# EAGLE schematic Overview_Schematic (EAGLE 9.6.2)
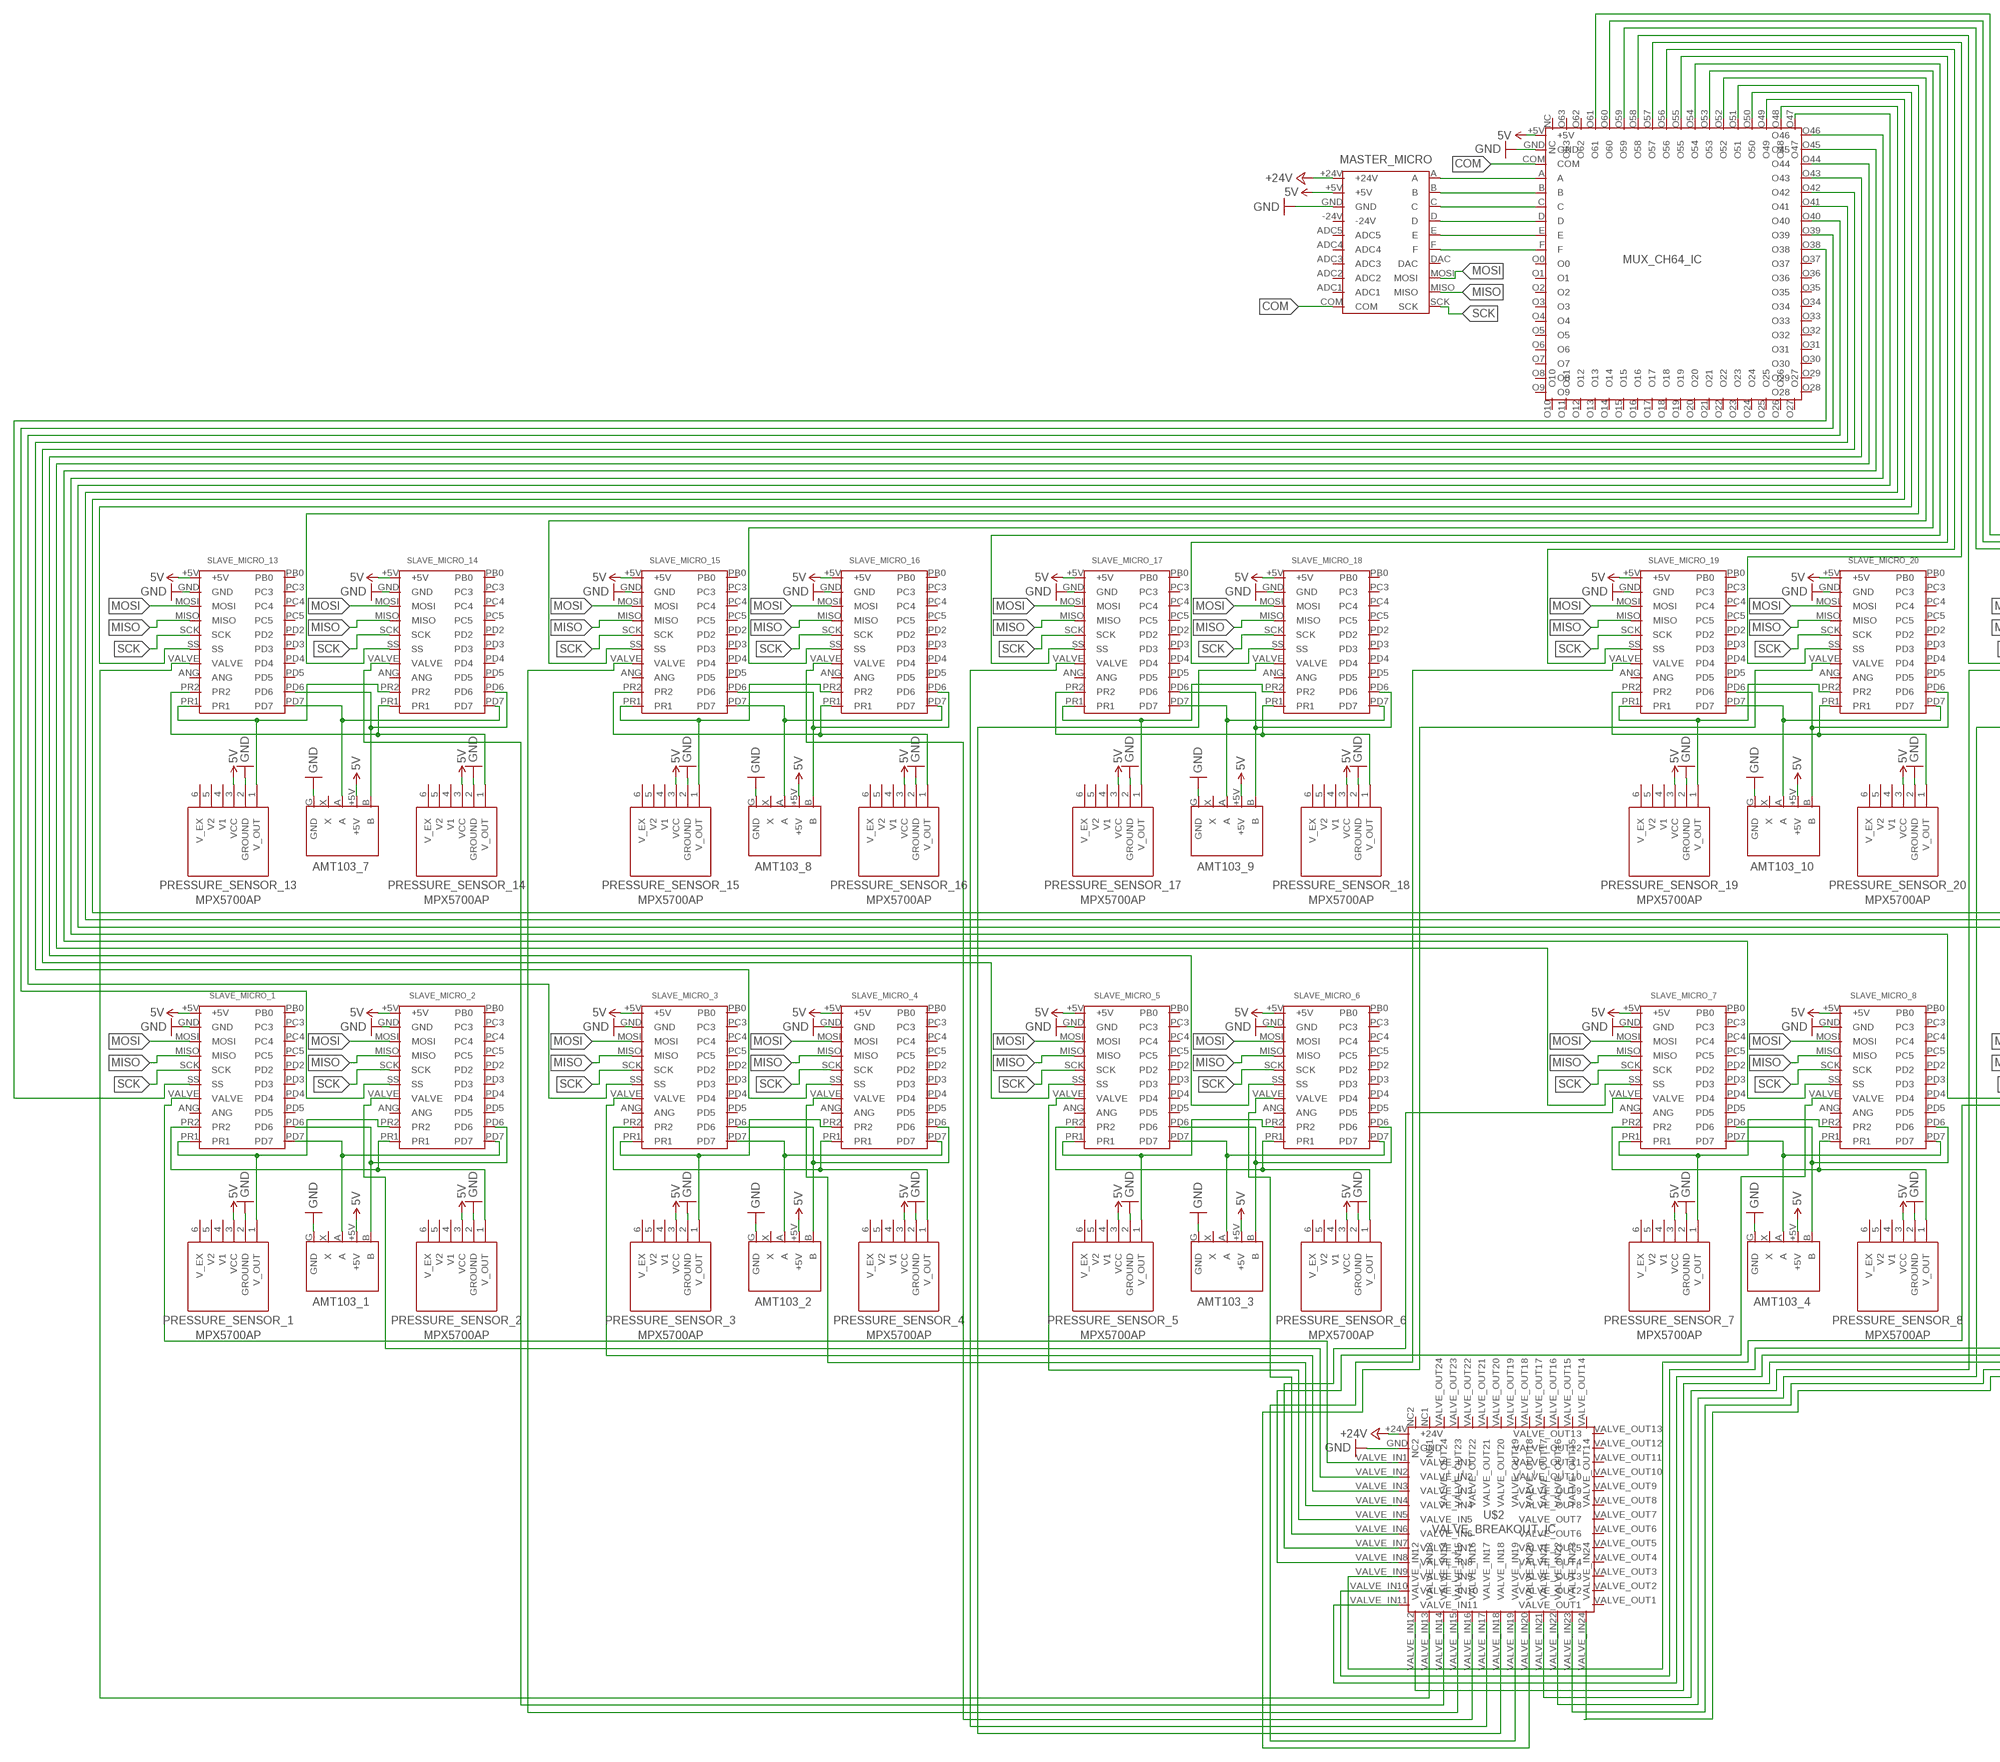
[diagram p0: schematic, sheet 1, part 1 of 2]
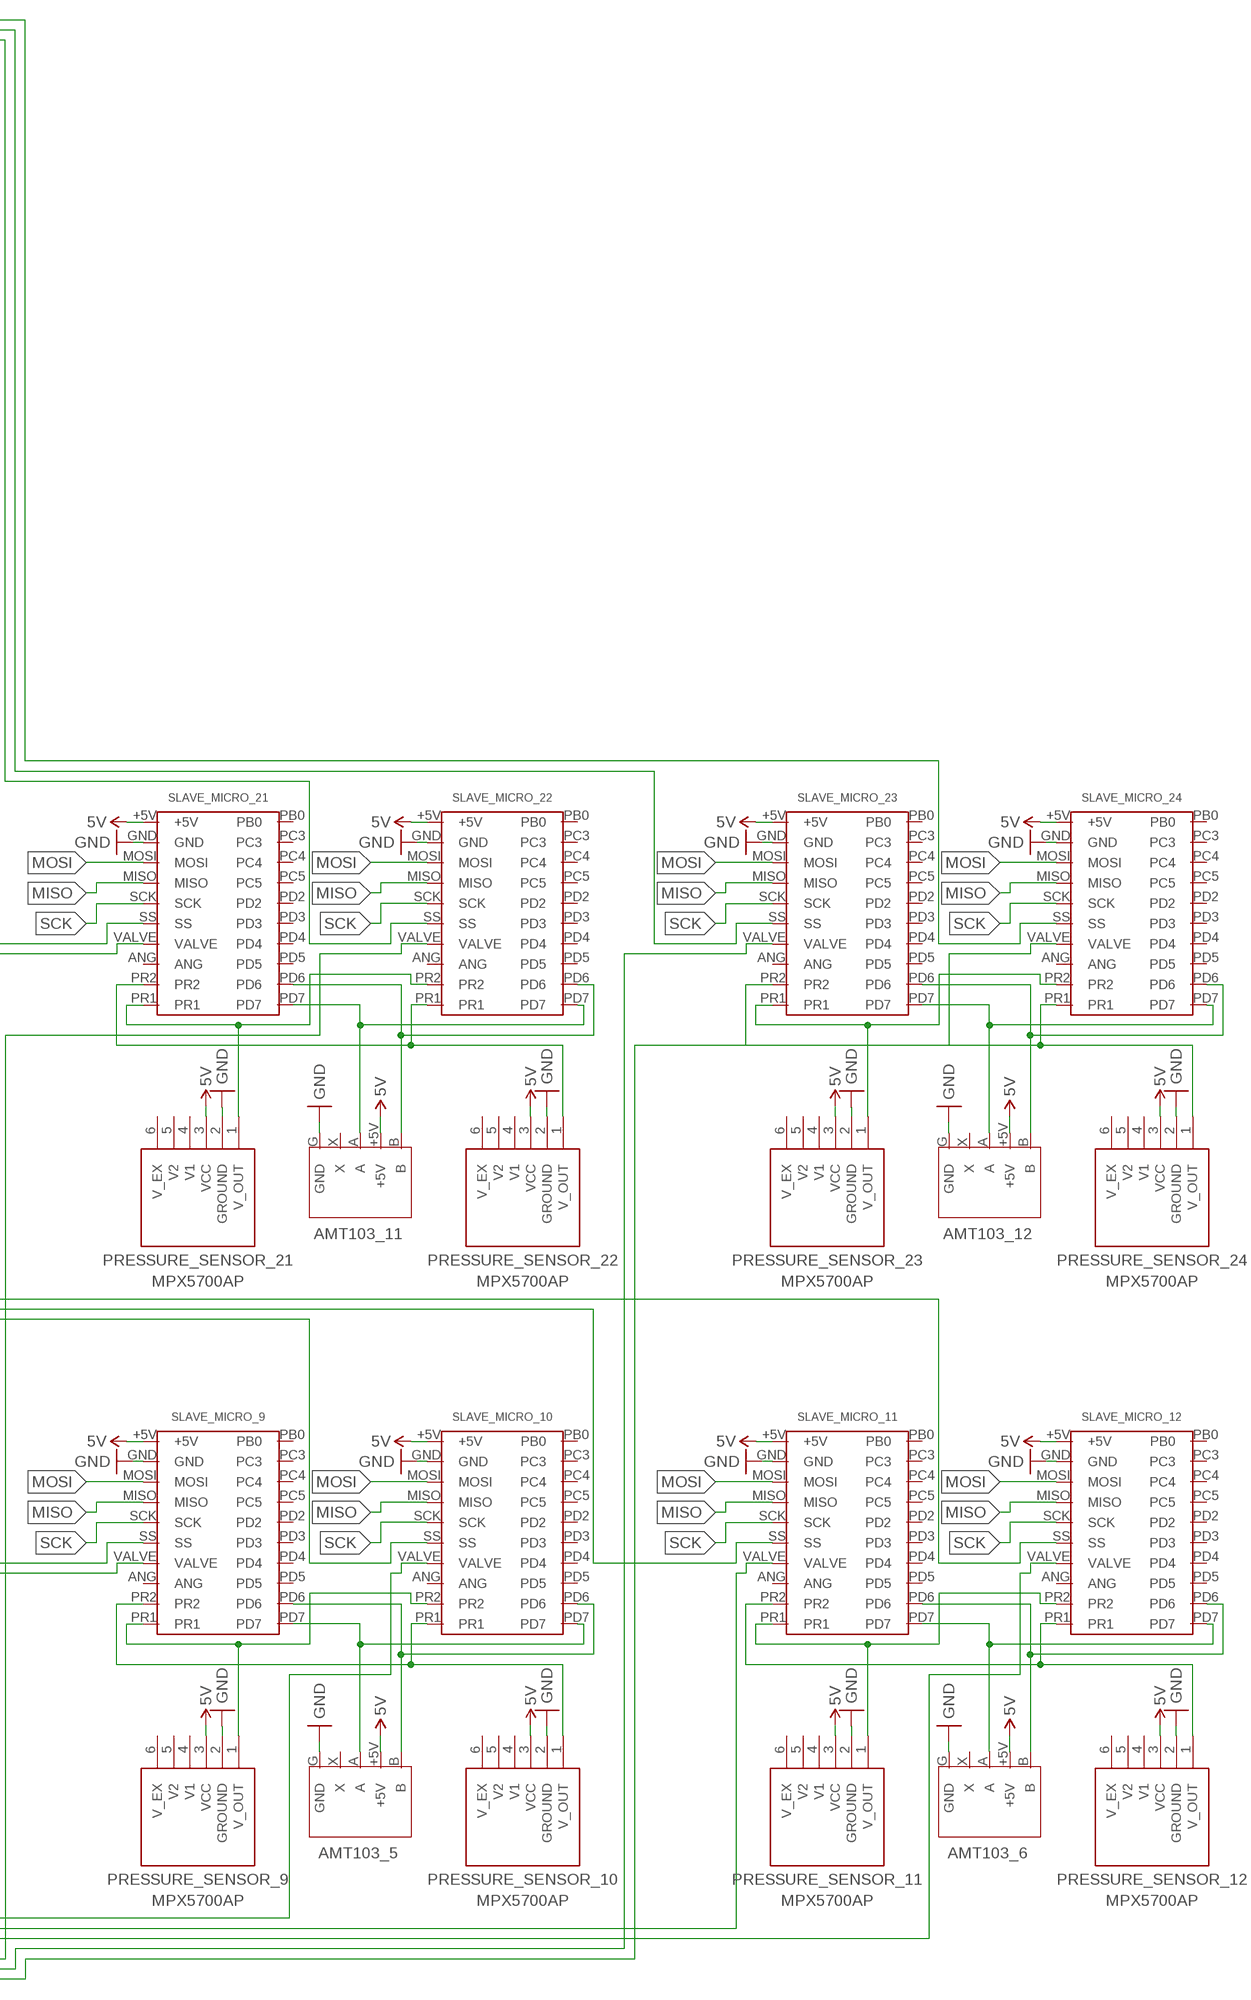
[diagram p1: schematic, sheet 1, part 2 of 2]

## Parts
AMT103_1  AMT103_ENCODER  [AMT103_ENCODER]
AMT103_2  AMT103_ENCODER  [AMT103_ENCODER]
AMT103_3  AMT103_ENCODER  [AMT103_ENCODER]
AMT103_4  AMT103_ENCODER  [AMT103_ENCODER]
AMT103_5  AMT103_ENCODER  [AMT103_ENCODER]
AMT103_6  AMT103_ENCODER  [AMT103_ENCODER]
AMT103_7  AMT103_ENCODER  [AMT103_ENCODER]
AMT103_8  AMT103_ENCODER  [AMT103_ENCODER]
AMT103_9  AMT103_ENCODER  [AMT103_ENCODER]
AMT103_10  AMT103_ENCODER  [AMT103_ENCODER]
AMT103_11  AMT103_ENCODER  [AMT103_ENCODER]
AMT103_12  AMT103_ENCODER  [AMT103_ENCODER]
MASTER_MICRO  MASTER_MICRO  [MASTER_MICRO]
MUX_CH64_IC  MUX_64CH_IC  [MUX_64CH_IC]
PRESSURE_SENSOR_1  MPX5700AP  [MPX5700AP]
PRESSURE_SENSOR_2  MPX5700AP  [MPX5700AP]
PRESSURE_SENSOR_3  MPX5700AP  [MPX5700AP]
PRESSURE_SENSOR_4  MPX5700AP  [MPX5700AP]
PRESSURE_SENSOR_5  MPX5700AP  [MPX5700AP]
PRESSURE_SENSOR_6  MPX5700AP  [MPX5700AP]
PRESSURE_SENSOR_7  MPX5700AP  [MPX5700AP]
PRESSURE_SENSOR_8  MPX5700AP  [MPX5700AP]
PRESSURE_SENSOR_9  MPX5700AP  [MPX5700AP]
PRESSURE_SENSOR_10  MPX5700AP  [MPX5700AP]
PRESSURE_SENSOR_11  MPX5700AP  [MPX5700AP]
PRESSURE_SENSOR_12  MPX5700AP  [MPX5700AP]
PRESSURE_SENSOR_13  MPX5700AP  [MPX5700AP]
PRESSURE_SENSOR_14  MPX5700AP  [MPX5700AP]
PRESSURE_SENSOR_15  MPX5700AP  [MPX5700AP]
PRESSURE_SENSOR_16  MPX5700AP  [MPX5700AP]
PRESSURE_SENSOR_17  MPX5700AP  [MPX5700AP]
PRESSURE_SENSOR_18  MPX5700AP  [MPX5700AP]
PRESSURE_SENSOR_19  MPX5700AP  [MPX5700AP]
PRESSURE_SENSOR_20  MPX5700AP  [MPX5700AP]
PRESSURE_SENSOR_21  MPX5700AP  [MPX5700AP]
PRESSURE_SENSOR_22  MPX5700AP  [MPX5700AP]
PRESSURE_SENSOR_23  MPX5700AP  [MPX5700AP]
PRESSURE_SENSOR_24  MPX5700AP  [MPX5700AP]
SLAVE_MICRO_1  SLAVE_MICRO  [SLAVE_MICRO]
SLAVE_MICRO_2  SLAVE_MICRO  [SLAVE_MICRO]
SLAVE_MICRO_3  SLAVE_MICRO  [SLAVE_MICRO]
SLAVE_MICRO_4  SLAVE_MICRO  [SLAVE_MICRO]
SLAVE_MICRO_5  SLAVE_MICRO  [SLAVE_MICRO]
SLAVE_MICRO_6  SLAVE_MICRO  [SLAVE_MICRO]
SLAVE_MICRO_7  SLAVE_MICRO  [SLAVE_MICRO]
SLAVE_MICRO_8  SLAVE_MICRO  [SLAVE_MICRO]
SLAVE_MICRO_9  SLAVE_MICRO  [SLAVE_MICRO]
SLAVE_MICRO_10  SLAVE_MICRO  [SLAVE_MICRO]
SLAVE_MICRO_11  SLAVE_MICRO  [SLAVE_MICRO]
SLAVE_MICRO_12  SLAVE_MICRO  [SLAVE_MICRO]
SLAVE_MICRO_13  SLAVE_MICRO  [SLAVE_MICRO]
SLAVE_MICRO_14  SLAVE_MICRO  [SLAVE_MICRO]
SLAVE_MICRO_15  SLAVE_MICRO  [SLAVE_MICRO]
SLAVE_MICRO_16  SLAVE_MICRO  [SLAVE_MICRO]
SLAVE_MICRO_17  SLAVE_MICRO  [SLAVE_MICRO]
SLAVE_MICRO_18  SLAVE_MICRO  [SLAVE_MICRO]
SLAVE_MICRO_19  SLAVE_MICRO  [SLAVE_MICRO]
SLAVE_MICRO_20  SLAVE_MICRO  [SLAVE_MICRO]
SLAVE_MICRO_21  SLAVE_MICRO  [SLAVE_MICRO]
SLAVE_MICRO_22  SLAVE_MICRO  [SLAVE_MICRO]
SLAVE_MICRO_23  SLAVE_MICRO  [SLAVE_MICRO]
SLAVE_MICRO_24  SLAVE_MICRO  [SLAVE_MICRO]
U$2  VALVE_BREAKOUT_IC  [VALVE_BREAKOUT_IC]

## Nets
5V: AMT103_1.+5V AMT103_2.+5V AMT103_3.+5V AMT103_4.+5V AMT103_5.+5V AMT103_6.+5V AMT103_7.+5V AMT103_8.+5V AMT103_9.+5V AMT103_10.+5V AMT103_11.+5V AMT103_12.+5V MASTER_MICRO.+5V MUX_CH64_IC.+5V PRESSURE_SENSOR_1.3(VCC) PRESSURE_SENSOR_2.3(VCC) PRESSURE_SENSOR_3.3(VCC) PRESSURE_SENSOR_4.3(VCC) PRESSURE_SENSOR_5.3(VCC) PRESSURE_SENSOR_6.3(VCC) PRESSURE_SENSOR_7.3(VCC) PRESSURE_SENSOR_8.3(VCC) PRESSURE_SENSOR_9.3(VCC) PRESSURE_SENSOR_10.3(VCC) PRESSURE_SENSOR_11.3(VCC) PRESSURE_SENSOR_12.3(VCC) PRESSURE_SENSOR_13.3(VCC) PRESSURE_SENSOR_14.3(VCC) PRESSURE_SENSOR_15.3(VCC) PRESSURE_SENSOR_16.3(VCC) PRESSURE_SENSOR_17.3(VCC) PRESSURE_SENSOR_18.3(VCC) PRESSURE_SENSOR_19.3(VCC) PRESSURE_SENSOR_20.3(VCC) PRESSURE_SENSOR_21.3(VCC) PRESSURE_SENSOR_22.3(VCC) PRESSURE_SENSOR_23.3(VCC) PRESSURE_SENSOR_24.3(VCC) SLAVE_MICRO_1.+5V SLAVE_MICRO_2.+5V SLAVE_MICRO_3.+5V SLAVE_MICRO_4.+5V SLAVE_MICRO_5.+5V SLAVE_MICRO_6.+5V SLAVE_MICRO_7.+5V SLAVE_MICRO_8.+5V SLAVE_MICRO_9.+5V SLAVE_MICRO_10.+5V SLAVE_MICRO_11.+5V SLAVE_MICRO_12.+5V SLAVE_MICRO_13.+5V SLAVE_MICRO_14.+5V SLAVE_MICRO_15.+5V SLAVE_MICRO_16.+5V SLAVE_MICRO_17.+5V SLAVE_MICRO_18.+5V SLAVE_MICRO_19.+5V SLAVE_MICRO_20.+5V SLAVE_MICRO_21.+5V SLAVE_MICRO_22.+5V SLAVE_MICRO_23.+5V SLAVE_MICRO_24.+5V
+24V: MASTER_MICRO.+24V U$2.+24V
COM: MASTER_MICRO.COM MUX_CH64_IC.COM
GND: AMT103_1.G(GND) AMT103_2.G(GND) AMT103_3.G(GND) AMT103_4.G(GND) AMT103_5.G(GND) AMT103_6.G(GND) AMT103_7.G(GND) AMT103_8.G(GND) AMT103_9.G(GND) AMT103_10.G(GND) AMT103_11.G(GND) AMT103_12.G(GND) MASTER_MICRO.GND MUX_CH64_IC.GND PRESSURE_SENSOR_1.2(GROUND) PRESSURE_SENSOR_2.2(GROUND) PRESSURE_SENSOR_3.2(GROUND) PRESSURE_SENSOR_4.2(GROUND) PRESSURE_SENSOR_5.2(GROUND) PRESSURE_SENSOR_6.2(GROUND) PRESSURE_SENSOR_7.2(GROUND) PRESSURE_SENSOR_8.2(GROUND) PRESSURE_SENSOR_9.2(GROUND) PRESSURE_SENSOR_10.2(GROUND) PRESSURE_SENSOR_11.2(GROUND) PRESSURE_SENSOR_12.2(GROUND) PRESSURE_SENSOR_13.2(GROUND) PRESSURE_SENSOR_14.2(GROUND) PRESSURE_SENSOR_15.2(GROUND) PRESSURE_SENSOR_16.2(GROUND) PRESSURE_SENSOR_17.2(GROUND) PRESSURE_SENSOR_18.2(GROUND) PRESSURE_SENSOR_19.2(GROUND) PRESSURE_SENSOR_20.2(GROUND) PRESSURE_SENSOR_21.2(GROUND) PRESSURE_SENSOR_22.2(GROUND) PRESSURE_SENSOR_23.2(GROUND) PRESSURE_SENSOR_24.2(GROUND) SLAVE_MICRO_1.GND SLAVE_MICRO_2.GND SLAVE_MICRO_3.GND SLAVE_MICRO_4.GND SLAVE_MICRO_5.GND SLAVE_MICRO_6.GND SLAVE_MICRO_7.GND SLAVE_MICRO_8.GND SLAVE_MICRO_9.GND SLAVE_MICRO_10.GND SLAVE_MICRO_11.GND SLAVE_MICRO_12.GND SLAVE_MICRO_13.GND SLAVE_MICRO_14.GND SLAVE_MICRO_15.GND SLAVE_MICRO_16.GND SLAVE_MICRO_17.GND SLAVE_MICRO_18.GND SLAVE_MICRO_19.GND SLAVE_MICRO_20.GND SLAVE_MICRO_21.GND SLAVE_MICRO_22.GND SLAVE_MICRO_23.GND SLAVE_MICRO_24.GND U$2.GND
MISO: MASTER_MICRO.MISO SLAVE_MICRO_1.MISO SLAVE_MICRO_2.MISO SLAVE_MICRO_3.MISO SLAVE_MICRO_4.MISO SLAVE_MICRO_5.MISO SLAVE_MICRO_6.MISO SLAVE_MICRO_7.MISO SLAVE_MICRO_8.MISO SLAVE_MICRO_9.MISO SLAVE_MICRO_10.MISO SLAVE_MICRO_11.MISO SLAVE_MICRO_12.MISO SLAVE_MICRO_13.MISO SLAVE_MICRO_14.MISO SLAVE_MICRO_15.MISO SLAVE_MICRO_16.MISO SLAVE_MICRO_17.MISO SLAVE_MICRO_18.MISO SLAVE_MICRO_19.MISO SLAVE_MICRO_20.MISO SLAVE_MICRO_21.MISO SLAVE_MICRO_22.MISO SLAVE_MICRO_23.MISO SLAVE_MICRO_24.MISO
MOSI: MASTER_MICRO.MOSI SLAVE_MICRO_1.MOSI SLAVE_MICRO_2.MOSI SLAVE_MICRO_3.MOSI SLAVE_MICRO_4.MOSI SLAVE_MICRO_5.MOSI SLAVE_MICRO_6.MOSI SLAVE_MICRO_7.MOSI SLAVE_MICRO_8.MOSI SLAVE_MICRO_9.MOSI SLAVE_MICRO_10.MOSI SLAVE_MICRO_11.MOSI SLAVE_MICRO_12.MOSI SLAVE_MICRO_13.MOSI SLAVE_MICRO_14.MOSI SLAVE_MICRO_15.MOSI SLAVE_MICRO_16.MOSI SLAVE_MICRO_17.MOSI SLAVE_MICRO_18.MOSI SLAVE_MICRO_19.MOSI SLAVE_MICRO_20.MOSI SLAVE_MICRO_21.MOSI SLAVE_MICRO_22.MOSI SLAVE_MICRO_23.MOSI SLAVE_MICRO_24.MOSI
N$1: MASTER_MICRO.A MUX_CH64_IC.A
N$2: MASTER_MICRO.B MUX_CH64_IC.B
N$3: MASTER_MICRO.C MUX_CH64_IC.C
N$4: MASTER_MICRO.D MUX_CH64_IC.D
N$5: MASTER_MICRO.E MUX_CH64_IC.E
N$6: MASTER_MICRO.F MUX_CH64_IC.F
N$7: MUX_CH64_IC.O38 SLAVE_MICRO_1.SS
N$8: AMT103_1.A SLAVE_MICRO_1.PD7 SLAVE_MICRO_2.PD7
N$9: AMT103_1.B SLAVE_MICRO_1.PD6 SLAVE_MICRO_2.PD6
N$10: PRESSURE_SENSOR_1.1(V_OUT) SLAVE_MICRO_1.PR1 SLAVE_MICRO_2.PR2
N$11: MUX_CH64_IC.O39 SLAVE_MICRO_2.SS
N$12: PRESSURE_SENSOR_2.1(V_OUT) SLAVE_MICRO_1.PR2 SLAVE_MICRO_2.PR1
N$13: MUX_CH64_IC.O40 SLAVE_MICRO_3.SS
N$14: MUX_CH64_IC.O41 SLAVE_MICRO_4.SS
N$15: AMT103_2.A SLAVE_MICRO_3.PD7 SLAVE_MICRO_4.PD7
N$16: AMT103_2.B SLAVE_MICRO_3.PD6 SLAVE_MICRO_4.PD6
N$17: PRESSURE_SENSOR_3.1(V_OUT) SLAVE_MICRO_3.PR1 SLAVE_MICRO_4.PR2
N$18: PRESSURE_SENSOR_4.1(V_OUT) SLAVE_MICRO_3.PR2 SLAVE_MICRO_4.PR1
N$19: MUX_CH64_IC.O42 SLAVE_MICRO_5.SS
N$20: MUX_CH64_IC.O43 SLAVE_MICRO_6.SS
N$21: AMT103_3.A SLAVE_MICRO_5.PD7 SLAVE_MICRO_6.PD7
N$22: AMT103_3.B SLAVE_MICRO_5.PD6 SLAVE_MICRO_6.PD6
N$23: PRESSURE_SENSOR_5.1(V_OUT) SLAVE_MICRO_5.PR1 SLAVE_MICRO_6.PR2
N$24: PRESSURE_SENSOR_6.1(V_OUT) SLAVE_MICRO_5.PR2 SLAVE_MICRO_6.PR1
N$25: MUX_CH64_IC.O44 SLAVE_MICRO_7.SS
N$26: MUX_CH64_IC.O45 SLAVE_MICRO_8.SS
N$27: AMT103_4.A SLAVE_MICRO_7.PD7 SLAVE_MICRO_8.PD7
N$28: AMT103_4.B SLAVE_MICRO_7.PD6 SLAVE_MICRO_8.PD6
N$29: PRESSURE_SENSOR_7.1(V_OUT) SLAVE_MICRO_7.PR1 SLAVE_MICRO_8.PR2
N$30: PRESSURE_SENSOR_8.1(V_OUT) SLAVE_MICRO_7.PR2 SLAVE_MICRO_8.PR1
N$31: MUX_CH64_IC.O46 SLAVE_MICRO_9.SS
N$32: MUX_CH64_IC.O47 SLAVE_MICRO_10.SS
N$33: AMT103_5.A SLAVE_MICRO_9.PD7 SLAVE_MICRO_10.PD7
N$34: AMT103_5.B SLAVE_MICRO_9.PD6 SLAVE_MICRO_10.PD6
N$35: PRESSURE_SENSOR_9.1(V_OUT) SLAVE_MICRO_9.PR1 SLAVE_MICRO_10.PR2
N$36: PRESSURE_SENSOR_10.1(V_OUT) SLAVE_MICRO_9.PR2 SLAVE_MICRO_10.PR1
N$37: MUX_CH64_IC.O48 SLAVE_MICRO_11.SS
N$38: MUX_CH64_IC.O49 SLAVE_MICRO_12.SS
N$39: AMT103_6.A SLAVE_MICRO_11.PD7 SLAVE_MICRO_12.PD7
N$40: AMT103_6.B SLAVE_MICRO_11.PD6 SLAVE_MICRO_12.PD6
N$41: PRESSURE_SENSOR_11.1(V_OUT) SLAVE_MICRO_11.PR1 SLAVE_MICRO_12.PR2
N$42: PRESSURE_SENSOR_12.1(V_OUT) SLAVE_MICRO_11.PR2 SLAVE_MICRO_12.PR1
N$43: MUX_CH64_IC.O50 SLAVE_MICRO_13.SS
N$44: MUX_CH64_IC.O51 SLAVE_MICRO_14.SS
N$45: AMT103_7.A SLAVE_MICRO_13.PD7 SLAVE_MICRO_14.PD7
N$46: AMT103_7.B SLAVE_MICRO_13.PD6 SLAVE_MICRO_14.PD6
N$47: PRESSURE_SENSOR_13.1(V_OUT) SLAVE_MICRO_13.PR1 SLAVE_MICRO_14.PR2
N$48: PRESSURE_SENSOR_14.1(V_OUT) SLAVE_MICRO_13.PR2 SLAVE_MICRO_14.PR1
N$49: MUX_CH64_IC.O52 SLAVE_MICRO_15.SS
N$50: MUX_CH64_IC.O53 SLAVE_MICRO_16.SS
N$51: AMT103_8.A SLAVE_MICRO_15.PD7 SLAVE_MICRO_16.PD7
N$52: AMT103_8.B SLAVE_MICRO_15.PD6 SLAVE_MICRO_16.PD6
N$53: PRESSURE_SENSOR_15.1(V_OUT) SLAVE_MICRO_15.PR1 SLAVE_MICRO_16.PR2
N$54: PRESSURE_SENSOR_16.1(V_OUT) SLAVE_MICRO_15.PR2 SLAVE_MICRO_16.PR1
N$55: MUX_CH64_IC.O54 SLAVE_MICRO_17.SS
N$56: MUX_CH64_IC.O55 SLAVE_MICRO_18.SS
N$57: AMT103_9.A SLAVE_MICRO_17.PD7 SLAVE_MICRO_18.PD7
N$58: AMT103_9.B SLAVE_MICRO_17.PD6 SLAVE_MICRO_18.PD6
N$59: PRESSURE_SENSOR_17.1(V_OUT) SLAVE_MICRO_17.PR1 SLAVE_MICRO_18.PR2
N$60: PRESSURE_SENSOR_18.1(V_OUT) SLAVE_MICRO_17.PR2 SLAVE_MICRO_18.PR1
N$61: MUX_CH64_IC.O56 SLAVE_MICRO_19.SS
N$62: MUX_CH64_IC.O57 SLAVE_MICRO_20.SS
N$63: AMT103_10.A SLAVE_MICRO_19.PD7 SLAVE_MICRO_20.PD7
N$64: AMT103_10.B SLAVE_MICRO_19.PD6 SLAVE_MICRO_20.PD6
N$65: PRESSURE_SENSOR_19.1(V_OUT) SLAVE_MICRO_19.PR1 SLAVE_MICRO_20.PR2
N$66: PRESSURE_SENSOR_20.1(V_OUT) SLAVE_MICRO_19.PR2 SLAVE_MICRO_20.PR1
N$67: MUX_CH64_IC.O58 SLAVE_MICRO_21.SS
N$68: MUX_CH64_IC.O59 SLAVE_MICRO_22.SS
N$69: AMT103_11.A SLAVE_MICRO_21.PD7 SLAVE_MICRO_22.PD7
N$70: AMT103_11.B SLAVE_MICRO_21.PD6 SLAVE_MICRO_22.PD6
N$71: PRESSURE_SENSOR_21.1(V_OUT) SLAVE_MICRO_21.PR1 SLAVE_MICRO_22.PR2
N$72: PRESSURE_SENSOR_22.1(V_OUT) SLAVE_MICRO_21.PR2 SLAVE_MICRO_22.PR1
N$73: MUX_CH64_IC.O60 SLAVE_MICRO_23.SS
N$74: MUX_CH64_IC.O61 SLAVE_MICRO_24.SS
N$75: AMT103_12.A SLAVE_MICRO_23.PD7 SLAVE_MICRO_24.PD7
N$76: AMT103_12.B SLAVE_MICRO_23.PD6 SLAVE_MICRO_24.PD6
N$77: PRESSURE_SENSOR_23.1(V_OUT) SLAVE_MICRO_23.PR1 SLAVE_MICRO_24.PR2
N$78: PRESSURE_SENSOR_24.1(V_OUT) SLAVE_MICRO_23.PR2 SLAVE_MICRO_24.PR1
N$79: SLAVE_MICRO_1.VALVE U$2.VALVE_IN1
N$80: SLAVE_MICRO_2.VALVE U$2.VALVE_IN2
N$81: SLAVE_MICRO_3.VALVE U$2.VALVE_IN3
N$82: SLAVE_MICRO_4.VALVE U$2.VALVE_IN4
N$83: SLAVE_MICRO_5.VALVE U$2.VALVE_IN5
N$84: SLAVE_MICRO_6.VALVE U$2.VALVE_IN6
N$85: SLAVE_MICRO_7.VALVE U$2.VALVE_IN7
N$86: SLAVE_MICRO_8.VALVE U$2.VALVE_IN8
N$87: SLAVE_MICRO_9.VALVE U$2.VALVE_IN9
N$88: SLAVE_MICRO_10.VALVE U$2.VALVE_IN10
N$89: SLAVE_MICRO_11.VALVE U$2.VALVE_IN11
N$90: SLAVE_MICRO_12.VALVE U$2.VALVE_IN12
N$91: SLAVE_MICRO_13.VALVE U$2.VALVE_IN13
N$92: SLAVE_MICRO_14.VALVE U$2.VALVE_IN14
N$93: SLAVE_MICRO_15.VALVE U$2.VALVE_IN15
N$94: SLAVE_MICRO_16.VALVE U$2.VALVE_IN16
N$95: SLAVE_MICRO_17.VALVE U$2.VALVE_IN17
N$96: SLAVE_MICRO_18.VALVE U$2.VALVE_IN18
N$97: SLAVE_MICRO_19.VALVE U$2.VALVE_IN19
N$98: SLAVE_MICRO_20.VALVE U$2.VALVE_IN20
N$99: SLAVE_MICRO_21.VALVE U$2.VALVE_IN21
N$100: SLAVE_MICRO_22.VALVE U$2.VALVE_IN22
N$101: SLAVE_MICRO_23.VALVE U$2.VALVE_IN23
N$102: SLAVE_MICRO_24.VALVE U$2.VALVE_IN24
SCK: MASTER_MICRO.SCK SLAVE_MICRO_1.SCK SLAVE_MICRO_2.SCK SLAVE_MICRO_3.SCK SLAVE_MICRO_4.SCK SLAVE_MICRO_5.SCK SLAVE_MICRO_6.SCK SLAVE_MICRO_7.SCK SLAVE_MICRO_8.SCK SLAVE_MICRO_9.SCK SLAVE_MICRO_10.SCK SLAVE_MICRO_11.SCK SLAVE_MICRO_12.SCK SLAVE_MICRO_13.SCK SLAVE_MICRO_14.SCK SLAVE_MICRO_15.SCK SLAVE_MICRO_16.SCK SLAVE_MICRO_17.SCK SLAVE_MICRO_18.SCK SLAVE_MICRO_19.SCK SLAVE_MICRO_20.SCK SLAVE_MICRO_21.SCK SLAVE_MICRO_22.SCK SLAVE_MICRO_23.SCK SLAVE_MICRO_24.SCK
Unconnected: AMT103_1.X AMT103_2.X AMT103_3.X AMT103_4.X AMT103_5.X AMT103_6.X AMT103_7.X AMT103_8.X AMT103_9.X AMT103_10.X AMT103_11.X AMT103_12.X MASTER_MICRO.-24V MASTER_MICRO.ADC1 MASTER_MICRO.ADC2 MASTER_MICRO.ADC3 MASTER_MICRO.ADC4 MASTER_MICRO.ADC5 MASTER_MICRO.DAC MUX_CH64_IC.NC MUX_CH64_IC.O0 MUX_CH64_IC.O1 MUX_CH64_IC.O2 MUX_CH64_IC.O3 MUX_CH64_IC.O4 MUX_CH64_IC.O5 MUX_CH64_IC.O6 MUX_CH64_IC.O7 MUX_CH64_IC.O8 MUX_CH64_IC.O9 MUX_CH64_IC.O10 MUX_CH64_IC.O11 MUX_CH64_IC.O12 MUX_CH64_IC.O13 MUX_CH64_IC.O14 MUX_CH64_IC.O15 MUX_CH64_IC.O16 MUX_CH64_IC.O17 MUX_CH64_IC.O18 MUX_CH64_IC.O19 MUX_CH64_IC.O20 MUX_CH64_IC.O21 MUX_CH64_IC.O22 MUX_CH64_IC.O23 MUX_CH64_IC.O24 MUX_CH64_IC.O25 MUX_CH64_IC.O26 MUX_CH64_IC.O27 MUX_CH64_IC.O28 MUX_CH64_IC.O29 MUX_CH64_IC.O30 MUX_CH64_IC.O31 MUX_CH64_IC.O32 MUX_CH64_IC.O33 MUX_CH64_IC.O34 MUX_CH64_IC.O35 MUX_CH64_IC.O36 MUX_CH64_IC.O37 MUX_CH64_IC.O62 MUX_CH64_IC.O63 PRESSURE_SENSOR_1.4(V1) PRESSURE_SENSOR_1.5(V2) PRESSURE_SENSOR_1.6(V_EX) PRESSURE_SENSOR_2.4(V1) PRESSURE_SENSOR_2.5(V2) PRESSURE_SENSOR_2.6(V_EX) PRESSURE_SENSOR_3.4(V1) PRESSURE_SENSOR_3.5(V2) PRESSURE_SENSOR_3.6(V_EX) PRESSURE_SENSOR_4.4(V1) PRESSURE_SENSOR_4.5(V2) PRESSURE_SENSOR_4.6(V_EX) PRESSURE_SENSOR_5.4(V1) PRESSURE_SENSOR_5.5(V2) PRESSURE_SENSOR_5.6(V_EX) PRESSURE_SENSOR_6.4(V1) PRESSURE_SENSOR_6.5(V2) PRESSURE_SENSOR_6.6(V_EX) PRESSURE_SENSOR_7.4(V1) PRESSURE_SENSOR_7.5(V2) PRESSURE_SENSOR_7.6(V_EX) PRESSURE_SENSOR_8.4(V1) PRESSURE_SENSOR_8.5(V2) PRESSURE_SENSOR_8.6(V_EX) PRESSURE_SENSOR_9.4(V1) PRESSURE_SENSOR_9.5(V2) PRESSURE_SENSOR_9.6(V_EX) PRESSURE_SENSOR_10.4(V1) PRESSURE_SENSOR_10.5(V2) PRESSURE_SENSOR_10.6(V_EX) PRESSURE_SENSOR_11.4(V1) PRESSURE_SENSOR_11.5(V2) PRESSURE_SENSOR_11.6(V_EX) PRESSURE_SENSOR_12.4(V1) PRESSURE_SENSOR_12.5(V2) PRESSURE_SENSOR_12.6(V_EX) PRESSURE_SENSOR_13.4(V1) PRESSURE_SENSOR_13.5(V2) PRESSURE_SENSOR_13.6(V_EX) PRESSURE_SENSOR_14.4(V1) PRESSURE_SENSOR_14.5(V2) PRESSURE_SENSOR_14.6(V_EX) PRESSURE_SENSOR_15.4(V1) PRESSURE_SENSOR_15.5(V2) PRESSURE_SENSOR_15.6(V_EX) PRESSURE_SENSOR_16.4(V1) PRESSURE_SENSOR_16.5(V2) PRESSURE_SENSOR_16.6(V_EX) PRESSURE_SENSOR_17.4(V1) PRESSURE_SENSOR_17.5(V2) PRESSURE_SENSOR_17.6(V_EX) PRESSURE_SENSOR_18.4(V1) PRESSURE_SENSOR_18.5(V2) PRESSURE_SENSOR_18.6(V_EX) PRESSURE_SENSOR_19.4(V1) PRESSURE_SENSOR_19.5(V2) PRESSURE_SENSOR_19.6(V_EX) PRESSURE_SENSOR_20.4(V1) PRESSURE_SENSOR_20.5(V2) PRESSURE_SENSOR_20.6(V_EX) PRESSURE_SENSOR_21.4(V1) PRESSURE_SENSOR_21.5(V2) PRESSURE_SENSOR_21.6(V_EX) PRESSURE_SENSOR_22.4(V1) PRESSURE_SENSOR_22.5(V2) PRESSURE_SENSOR_22.6(V_EX) PRESSURE_SENSOR_23.4(V1) PRESSURE_SENSOR_23.5(V2) PRESSURE_SENSOR_23.6(V_EX) PRESSURE_SENSOR_24.4(V1) PRESSURE_SENSOR_24.5(V2) PRESSURE_SENSOR_24.6(V_EX) SLAVE_MICRO_1.ANG SLAVE_MICRO_1.PB0 SLAVE_MICRO_1.PC3 SLAVE_MICRO_1.PC4 SLAVE_MICRO_1.PC5 SLAVE_MICRO_1.PD2 SLAVE_MICRO_1.PD3 SLAVE_MICRO_1.PD4 SLAVE_MICRO_1.PD5 SLAVE_MICRO_2.ANG SLAVE_MICRO_2.PB0 SLAVE_MICRO_2.PC3 SLAVE_MICRO_2.PC4 SLAVE_MICRO_2.PC5 SLAVE_MICRO_2.PD2 SLAVE_MICRO_2.PD3 SLAVE_MICRO_2.PD4 SLAVE_MICRO_2.PD5 SLAVE_MICRO_3.ANG SLAVE_MICRO_3.PB0 SLAVE_MICRO_3.PC3 SLAVE_MICRO_3.PC4 SLAVE_MICRO_3.PC5 SLAVE_MICRO_3.PD2 SLAVE_MICRO_3.PD3 SLAVE_MICRO_3.PD4 SLAVE_MICRO_3.PD5 SLAVE_MICRO_4.ANG SLAVE_MICRO_4.PB0 SLAVE_MICRO_4.PC3 SLAVE_MICRO_4.PC4 SLAVE_MICRO_4.PC5 SLAVE_MICRO_4.PD2 SLAVE_MICRO_4.PD3 SLAVE_MICRO_4.PD4 SLAVE_MICRO_4.PD5 SLAVE_MICRO_5.ANG SLAVE_MICRO_5.PB0 SLAVE_MICRO_5.PC3 SLAVE_MICRO_5.PC4 SLAVE_MICRO_5.PC5 SLAVE_MICRO_5.PD2 SLAVE_MICRO_5.PD3 SLAVE_MICRO_5.PD4 SLAVE_MICRO_5.PD5 SLAVE_MICRO_6.ANG SLAVE_MICRO_6.PB0 SLAVE_MICRO_6.PC3 SLAVE_MICRO_6.PC4 SLAVE_MICRO_6.PC5 SLAVE_MICRO_6.PD2 SLAVE_MICRO_6.PD3 SLAVE_MICRO_6.PD4 SLAVE_MICRO_6.PD5 SLAVE_MICRO_7.ANG SLAVE_MICRO_7.PB0 SLAVE_MICRO_7.PC3 SLAVE_MICRO_7.PC4 SLAVE_MICRO_7.PC5 SLAVE_MICRO_7.PD2 SLAVE_MICRO_7.PD3 SLAVE_MICRO_7.PD4 SLAVE_MICRO_7.PD5 SLAVE_MICRO_8.ANG SLAVE_MICRO_8.PB0 SLAVE_MICRO_8.PC3 SLAVE_MICRO_8.PC4 SLAVE_MICRO_8.PC5 SLAVE_MICRO_8.PD2 SLAVE_MICRO_8.PD3 SLAVE_MICRO_8.PD4 SLAVE_MICRO_8.PD5 SLAVE_MICRO_9.ANG SLAVE_MICRO_9.PB0 SLAVE_MICRO_9.PC3 SLAVE_MICRO_9.PC4 SLAVE_MICRO_9.PC5 SLAVE_MICRO_9.PD2 SLAVE_MICRO_9.PD3 SLAVE_MICRO_9.PD4 SLAVE_MICRO_9.PD5 SLAVE_MICRO_10.ANG SLAVE_MICRO_10.PB0 SLAVE_MICRO_10.PC3 SLAVE_MICRO_10.PC4 SLAVE_MICRO_10.PC5 SLAVE_MICRO_10.PD2 SLAVE_MICRO_10.PD3 SLAVE_MICRO_10.PD4 SLAVE_MICRO_10.PD5 SLAVE_MICRO_11.ANG SLAVE_MICRO_11.PB0 SLAVE_MICRO_11.PC3 SLAVE_MICRO_11.PC4 SLAVE_MICRO_11.PC5 SLAVE_MICRO_11.PD2 SLAVE_MICRO_11.PD3 SLAVE_MICRO_11.PD4 SLAVE_MICRO_11.PD5 SLAVE_MICRO_12.ANG SLAVE_MICRO_12.PB0 SLAVE_MICRO_12.PC3 SLAVE_MICRO_12.PC4 SLAVE_MICRO_12.PC5 SLAVE_MICRO_12.PD2 SLAVE_MICRO_12.PD3 SLAVE_MICRO_12.PD4 SLAVE_MICRO_12.PD5 SLAVE_MICRO_13.ANG SLAVE_MICRO_13.PB0 SLAVE_MICRO_13.PC3 SLAVE_MICRO_13.PC4 SLAVE_MICRO_13.PC5 SLAVE_MICRO_13.PD2 SLAVE_MICRO_13.PD3 SLAVE_MICRO_13.PD4 SLAVE_MICRO_13.PD5 SLAVE_MICRO_14.ANG SLAVE_MICRO_14.PB0 SLAVE_MICRO_14.PC3 SLAVE_MICRO_14.PC4 SLAVE_MICRO_14.PC5 SLAVE_MICRO_14.PD2 SLAVE_MICRO_14.PD3 SLAVE_MICRO_14.PD4 SLAVE_MICRO_14.PD5 SLAVE_MICRO_15.ANG SLAVE_MICRO_15.PB0 SLAVE_MICRO_15.PC3 SLAVE_MICRO_15.PC4 SLAVE_MICRO_15.PC5 SLAVE_MICRO_15.PD2 SLAVE_MICRO_15.PD3 SLAVE_MICRO_15.PD4 SLAVE_MICRO_15.PD5 SLAVE_MICRO_16.ANG SLAVE_MICRO_16.PB0 SLAVE_MICRO_16.PC3 SLAVE_MICRO_16.PC4 SLAVE_MICRO_16.PC5 SLAVE_MICRO_16.PD2 SLAVE_MICRO_16.PD3 SLAVE_MICRO_16.PD4 SLAVE_MICRO_16.PD5 SLAVE_MICRO_17.ANG SLAVE_MICRO_17.PB0 SLAVE_MICRO_17.PC3 SLAVE_MICRO_17.PC4 SLAVE_MICRO_17.PC5 SLAVE_MICRO_17.PD2 SLAVE_MICRO_17.PD3 SLAVE_MICRO_17.PD4 SLAVE_MICRO_17.PD5 SLAVE_MICRO_18.ANG SLAVE_MICRO_18.PB0 SLAVE_MICRO_18.PC3 SLAVE_MICRO_18.PC4 SLAVE_MICRO_18.PC5 SLAVE_MICRO_18.PD2 SLAVE_MICRO_18.PD3 SLAVE_MICRO_18.PD4 SLAVE_MICRO_18.PD5 SLAVE_MICRO_19.ANG SLAVE_MICRO_19.PB0 SLAVE_MICRO_19.PC3 SLAVE_MICRO_19.PC4 SLAVE_MICRO_19.PC5 SLAVE_MICRO_19.PD2 SLAVE_MICRO_19.PD3 SLAVE_MICRO_19.PD4 SLAVE_MICRO_19.PD5 SLAVE_MICRO_20.ANG SLAVE_MICRO_20.PB0 SLAVE_MICRO_20.PC3 SLAVE_MICRO_20.PC4 SLAVE_MICRO_20.PC5 SLAVE_MICRO_20.PD2 SLAVE_MICRO_20.PD3 SLAVE_MICRO_20.PD4 SLAVE_MICRO_20.PD5 SLAVE_MICRO_21.ANG SLAVE_MICRO_21.PB0 SLAVE_MICRO_21.PC3 SLAVE_MICRO_21.PC4 SLAVE_MICRO_21.PC5 SLAVE_MICRO_21.PD2 SLAVE_MICRO_21.PD3 SLAVE_MICRO_21.PD4 SLAVE_MICRO_21.PD5 SLAVE_MICRO_22.ANG SLAVE_MICRO_22.PB0 SLAVE_MICRO_22.PC3 SLAVE_MICRO_22.PC4 SLAVE_MICRO_22.PC5 SLAVE_MICRO_22.PD2 SLAVE_MICRO_22.PD3 SLAVE_MICRO_22.PD4 SLAVE_MICRO_22.PD5 SLAVE_MICRO_23.ANG SLAVE_MICRO_23.PB0 SLAVE_MICRO_23.PC3 SLAVE_MICRO_23.PC4 SLAVE_MICRO_23.PC5 SLAVE_MICRO_23.PD2 SLAVE_MICRO_23.PD3 SLAVE_MICRO_23.PD4 SLAVE_MICRO_23.PD5 SLAVE_MICRO_24.ANG SLAVE_MICRO_24.PB0 SLAVE_MICRO_24.PC3 SLAVE_MICRO_24.PC4 SLAVE_MICRO_24.PC5 SLAVE_MICRO_24.PD2 SLAVE_MICRO_24.PD3 SLAVE_MICRO_24.PD4 SLAVE_MICRO_24.PD5 U$2.NC1 U$2.NC2 U$2.VALVE_OUT1 U$2.VALVE_OUT2 U$2.VALVE_OUT3 U$2.VALVE_OUT4 U$2.VALVE_OUT5 U$2.VALVE_OUT6 U$2.VALVE_OUT7 U$2.VALVE_OUT8 U$2.VALVE_OUT9 U$2.VALVE_OUT10 U$2.VALVE_OUT11 U$2.VALVE_OUT12 U$2.VALVE_OUT13 U$2.VALVE_OUT14 U$2.VALVE_OUT15 U$2.VALVE_OUT16 U$2.VALVE_OUT17 U$2.VALVE_OUT18 U$2.VALVE_OUT19 U$2.VALVE_OUT20 U$2.VALVE_OUT21 U$2.VALVE_OUT22 U$2.VALVE_OUT23 U$2.VALVE_OUT24

## Library data of the parts
AMT103_1-AMT103_12 = Quadruped_Library:AMT103_ENCODER: AMT103 ENCODER
MASTER_MICRO = Quadruped_Library:MASTER_MICRO: Quadruped Master Microcontroller IC
MUX_CH64_IC = Quadruped_Library:MUX_64CH_IC: Quadruped 64 Ch Mux/Demux IC
PRESSURE_SENSOR_1-PRESSURE_SENSOR_24 = SamacSys_Parts:MPX5700AP: MPX5700AP, Absolute Pressure Sensor, 700kPa 0.2 V 4.7 V Output, 6-Pin Source: Datasheet <http://www.nxp.com/docs/en/data-sheet/MPX5700.pdf>; DESCRIPTION: MPX5700AP, Absolute Pressure Sensor, 700kPa 0.2 V 4.7 V Output, 6-Pin; HEIGHT: 29.34mm; MANUFACTURER_NAME: NXP; MANUFACTURER_PART_NUMBER: MPX5700AP; MOUSER_PART_NUMBER: 841-MPX5700AP; MOUSER_PRICE-STOCK: https://www.mouser.co.uk/ProductDetail/NXP-Semiconductors/MPX5700AP?qs=N2XN0KY4UWVn7Ey758TYKQ%3D%3D
SLAVE_MICRO_1-SLAVE_MICRO_24 = Quadruped_Library:SLAVE_MICRO: Quadruped Slave Microcontroller IC
U$2 = Quadruped_Library:VALVE_BREAKOUT_IC: Quadruped Valve Breakout IC